# Altium schematic sheet karmanDB_MCU.SchDoc
size A
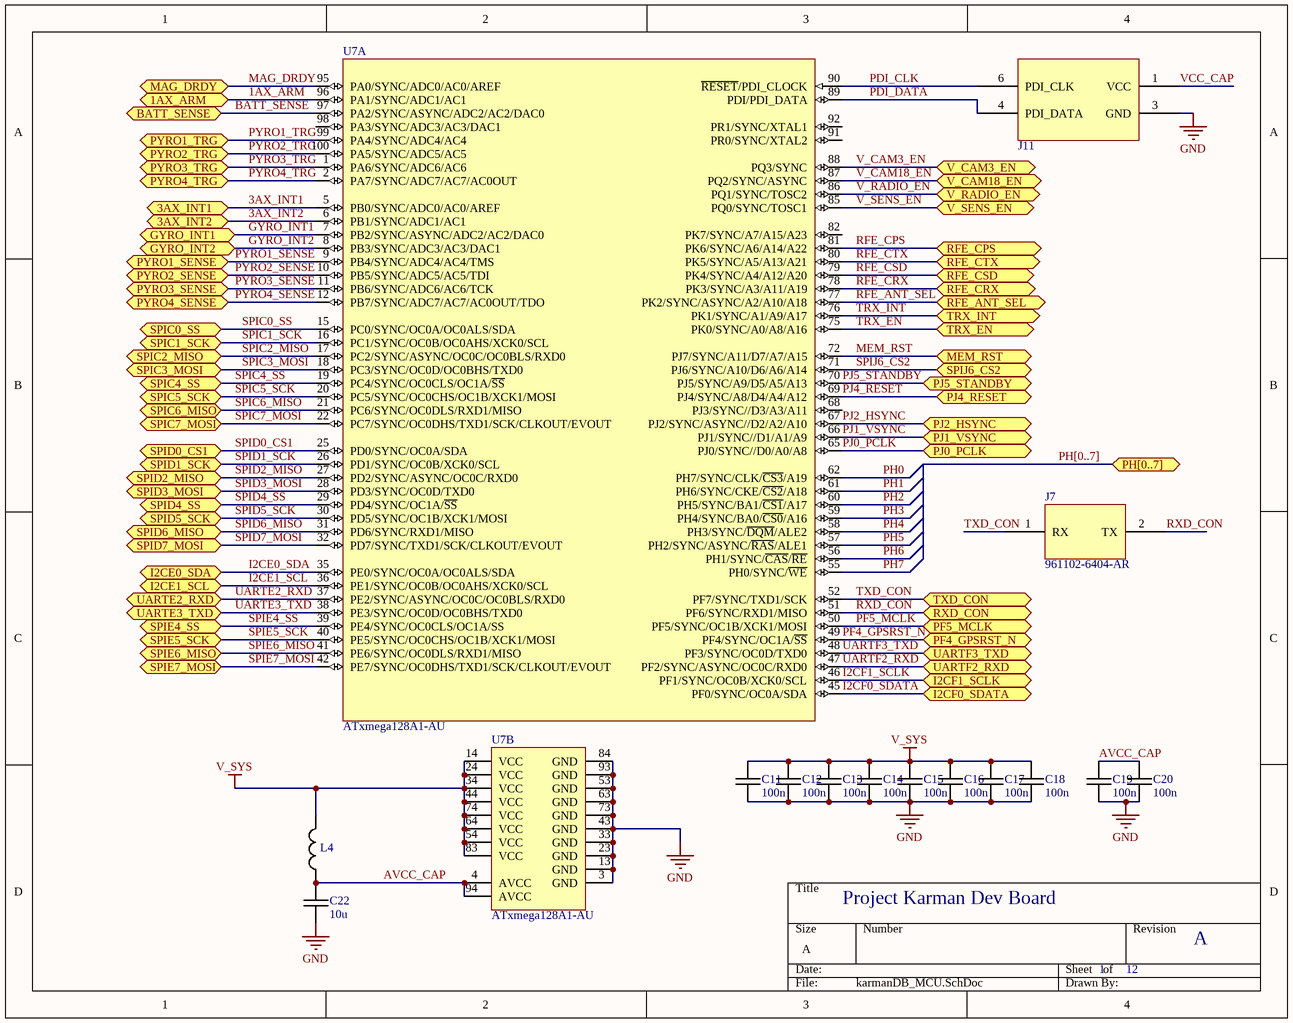
[diagram p0: karmanDB_MCU.SchDoc]

## Parts
C11  100n  [MURATA_GRM_0603]
C12  100n  [MURATA_GRM_0603]
C13  100n  [MURATA_GRM_0603]
C14  100n  [MURATA_GRM_0603]
C15  100n  [MURATA_GRM_0603]
C16  100n  [MURATA_GRM_0603]
C17  100n  [MURATA_GRM_0603]
C18  100n  [MURATA_GRM_0603]
C19  100n  [MURATA_GRM_0603]
C20  100n  [MURATA_GRM_0603]
C22  10u  [MURATA_GRM_0603]
J7  961102-6404-AR  [3M_961102-6X04]
J11  961206-6404-AR  [961206-6404-AR]  (value not drawn)
L4  BLM15BB221SN1D  [BLM15]  (value not drawn)
U7  ATxmega128A1-AU  [100A_N]  (parts A,B of 2)

## Ports
1AX_ARM (bidir), 3AX_INT1 (bidir), 3AX_INT2 (bidir), BATT_SENSE (bidir), GYRO_INT1 (bidir), GYRO_INT2 (bidir), I2CE0_SDA (bidir), I2CE1_SCL (bidir), I2CF0_SDATA (bidir), I2CF1_SCLK (bidir), MAG_DRDY (bidir), MEM_RST (bidir), PF4_GPSRST_N (bidir), PF5_MCLK (bidir), PH[0..7] (bidir), PJ0_PCLK (bidir), PJ1_VSYNC (bidir), PJ2_HSYNC (bidir), PJ4_RESET (bidir), PJ5_STANDBY (bidir), PYRO1_SENSE (bidir), PYRO1_TRG (bidir), PYRO2_SENSE (bidir), PYRO2_TRG (bidir), PYRO3_SENSE (bidir), PYRO3_TRG (bidir), PYRO4_SENSE (bidir), PYRO4_TRG (bidir), RFE_ANT_SEL (bidir), RFE_CPS (bidir), RFE_CRX (bidir), RFE_CSD (bidir), RFE_CTX (bidir), RXD_CON (bidir), SPIC0_SS (bidir), SPIC1_SCK (bidir), SPIC2_MISO (bidir), SPIC3_MOSI (bidir), SPIC4_SS (bidir), SPIC5_SCK (bidir), SPIC6_MISO (bidir), SPIC7_MOSI (bidir), SPID0_CS1 (bidir), SPID1_SCK (bidir), SPID2_MISO (bidir), SPID3_MOSI (bidir), SPID4_SS (bidir), SPID5_SCK (bidir), SPID6_MISO (bidir), SPID7_MOSI (bidir), SPIE4_SS (bidir), SPIE5_SCK (bidir), SPIE6_MISO (bidir), SPIE7_MOSI (bidir), SPIJ6_CS2 (bidir), TRX_EN (bidir), TRX_INT (bidir), TXD_CON (bidir), UARTE2_RXD (bidir), UARTE3_TXD (bidir), UARTF2_RXD (bidir), UARTF3_TXD (bidir), V_CAM3_EN (bidir), V_CAM18_EN (bidir), V_RADIO_EN (bidir), V_SENS_EN (bidir)

## Nets
GND: C11.2 C12.2 C13.2 C14.2 C15.2 C16.2 C17.2 C18.2 C19.2 C20.2 C22.2 J11.3(GND) U7.3(GND) U7.13(GND) U7.23(GND) U7.33(GND) U7.43(GND) U7.53(GND) U7.63(GND) U7.73(GND) U7.84(GND) U7.93(GND)
V_SYS: C11.1 C12.1 C13.1 C14.1 C15.1 C16.1 C17.1 C18.1 L4.2 U7.14(VCC) U7.24(VCC) U7.34(VCC) U7.44(VCC) U7.54(VCC) U7.64(VCC) U7.74(VCC) U7.83(VCC)
1AX_ARM: U7.96(PA1/SYNC/ADC1/AC1) ; port 1AX_ARM
3AX_INT1: U7.5(PB0/SYNC/ADC0/AC0/AREF) ; port 3AX_INT1
3AX_INT2: U7.6(PB1/SYNC/ADC1/AC1) ; port 3AX_INT2
AVCC_CAP: C19.1 C20.1 C22.1 L4.1 U7.4(AVCC) U7.94(AVCC)
BATT_SENSE: U7.97(PA2/SYNC/ASYNC/ADC2/AC2/DAC0) ; port BATT_SENSE
GYRO_INT1: U7.7(PB2/SYNC/ASYNC/ADC2/AC2/DAC0) ; port GYRO_INT1
GYRO_INT2: U7.8(PB3/SYNC/ADC3/AC3/DAC1) ; port GYRO_INT2
I2CE0_SDA: U7.35(PE0/SYNC/OC0A/OC0ALS/SDA) ; port I2CE0_SDA
I2CE1_SCL: U7.36(PE1/SYNC/OC0B/OC0AHS/XCK0/SCL) ; port I2CE1_SCL
I2CF0_SDATA: U7.45(PF0/SYNC/OC0A/SDA) ; port I2CF0_SDATA
I2CF1_SCLK: U7.46(PF1/SYNC/OC0B/XCK0/SCL) ; port I2CF1_SCLK
MAG_DRDY: U7.95(PA0/SYNC/ADC0/AC0/AREF) ; port MAG_DRDY
MEM_RST: U7.72(PJ7/SYNC/A11/D7/A7/A15) ; port MEM_RST
PDI_CLK: J11.6(PDI_CLK) U7.90(~{RESET}/PDI_CLOCK)
PDI_DATA: J11.4(PDI_DATA) U7.89(PDI/PDI_DATA)
PF4_GPSRST_N: U7.49(PF4/SYNC/OC1A/~{SS}) ; port PF4_GPSRST_N
PF5_MCLK: U7.50(PF5/SYNC/OC1B/XCK1/MOSI) ; port PF5_MCLK
PH0: U7.62(PH7/SYNC/CLK/~{CS3}/A19)
PH1: U7.61(PH6/SYNC/CKE/~{CS2}/A18)
PH2: U7.60(PH5/SYNC/BA1/~{CS1}/A17)
PH3: U7.59(PH4/SYNC/BA0/~{CS0}/A16)
PH4: U7.58(PH3/SYNC/~{DQM}/ALE2)
PH5: U7.57(PH2/SYNC/ASYNC/~{RAS}/ALE1)
PH6: U7.56(PH1/SYNC/~{CAS}/~{RE})
PH7: U7.55(PH0/SYNC/~{WE})
PJ0_PCLK: U7.65(PJ0/SYNC//D0/A0/A8) ; port PJ0_PCLK
PJ1_VSYNC: U7.66(PJ1/SYNC//D1/A1/A9) ; port PJ1_VSYNC
PJ2_HSYNC: U7.67(PJ2/SYNC/ASYNC//D2/A2/A10) ; port PJ2_HSYNC
PJ4_RESET: U7.69(PJ4/SYNC/A8/D4/A4/A12) ; port PJ4_RESET
PJ5_STANDBY: U7.70(PJ5/SYNC/A9/D5/A5/A13) ; port PJ5_STANDBY
PYRO1_SENSE: U7.9(PB4/SYNC/ADC4/AC4/TMS) ; port PYRO1_SENSE
PYRO1_TRG: U7.99(PA4/SYNC/ADC4/AC4) ; port PYRO1_TRG
PYRO2_SENSE: U7.10(PB5/SYNC/ADC5/AC5/TDI) ; port PYRO2_SENSE
PYRO2_TRG: U7.100(PA5/SYNC/ADC5/AC5) ; port PYRO2_TRG
PYRO3_SENSE: U7.11(PB6/SYNC/ADC6/AC6/TCK) ; port PYRO3_SENSE
PYRO3_TRG: U7.1(PA6/SYNC/ADC6/AC6) ; port PYRO3_TRG
PYRO4_SENSE: U7.12(PB7/SYNC/ADC7/AC7/AC0OUT/TDO) ; port PYRO4_SENSE
PYRO4_TRG: U7.2(PA7/SYNC/ADC7/AC7/AC0OUT) ; port PYRO4_TRG
RFE_ANT_SEL: U7.77(PK2/SYNC/ASYNC/A2/A10/A18) ; port RFE_ANT_SEL
RFE_CPS: U7.81(PK6/SYNC/A6/A14/A22) ; port RFE_CPS
RFE_CRX: U7.78(PK3/SYNC/A3/A11/A19) ; port RFE_CRX
RFE_CSD: U7.79(PK4/SYNC/A4/A12/A20) ; port RFE_CSD
RFE_CTX: U7.80(PK5/SYNC/A5/A13/A21) ; port RFE_CTX
RXD_CON: J7.2(TX) U7.51(PF6/SYNC/RXD1/MISO) ; port RXD_CON
SPIC0_SS: U7.15(PC0/SYNC/OC0A/OC0ALS/SDA) ; port SPIC0_SS
SPIC1_SCK: U7.16(PC1/SYNC/OC0B/OC0AHS/XCK0/SCL) ; port SPIC1_SCK
SPIC2_MISO: U7.17(PC2/SYNC/ASYNC/OC0C/OC0BLS/RXD0) ; port SPIC2_MISO
SPIC3_MOSI: U7.18(PC3/SYNC/OC0D/OC0BHS/TXD0) ; port SPIC3_MOSI
SPIC4_SS: U7.19(PC4/SYNC/OC0CLS/OC1A/~{SS}) ; port SPIC4_SS
SPIC5_SCK: U7.20(PC5/SYNC/OC0CHS/OC1B/XCK1/MOSI) ; port SPIC5_SCK
SPIC6_MISO: U7.21(PC6/SYNC/OC0DLS/RXD1/MISO) ; port SPIC6_MISO
SPIC7_MOSI: U7.22(PC7/SYNC/OC0DHS/TXD1/SCK/CLKOUT/EVOUT) ; port SPIC7_MOSI
SPID0_CS1: U7.25(PD0/SYNC/OC0A/SDA) ; port SPID0_CS1
SPID1_SCK: U7.26(PD1/SYNC/OC0B/XCK0/SCL) ; port SPID1_SCK
SPID2_MISO: U7.27(PD2/SYNC/ASYNC/OC0C/RXD0) ; port SPID2_MISO
SPID3_MOSI: U7.28(PD3/SYNC/OC0D/TXD0) ; port SPID3_MOSI
SPID4_SS: U7.29(PD4/SYNC/OC1A/~{SS}) ; port SPID4_SS
SPID5_SCK: U7.30(PD5/SYNC/OC1B/XCK1/MOSI) ; port SPID5_SCK
SPID6_MISO: U7.31(PD6/SYNC/RXD1/MISO) ; port SPID6_MISO
SPID7_MOSI: U7.32(PD7/SYNC/TXD1/SCK/CLKOUT/EVOUT) ; port SPID7_MOSI
SPIE4_SS: U7.39(PE4/SYNC/OC0CLS/OC1A/SS) ; port SPIE4_SS
SPIE5_SCK: U7.40(PE5/SYNC/OC0CHS/OC1B/XCK1/MOSI) ; port SPIE5_SCK
SPIE6_MISO: U7.41(PE6/SYNC/OC0DLS/RXD1/MISO) ; port SPIE6_MISO
SPIE7_MOSI: U7.42(PE7/SYNC/OC0DHS/TXD1/SCK/CLKOUT/EVOUT) ; port SPIE7_MOSI
SPIJ6_CS2: U7.71(PJ6/SYNC/A10/D6/A6/A14) ; port SPIJ6_CS2
TRX_EN: U7.75(PK0/SYNC/A0/A8/A16) ; port TRX_EN
TRX_INT: U7.76(PK1/SYNC/A1/A9/A17) ; port TRX_INT
TXD_CON: J7.1(RX) U7.52(PF7/SYNC/TXD1/SCK) ; port TXD_CON
UARTE2_RXD: U7.37(PE2/SYNC/ASYNC/OC0C/OC0BLS/RXD0) ; port UARTE2_RXD
UARTE3_TXD: U7.38(PE3/SYNC/OC0D/OC0BHS/TXD0) ; port UARTE3_TXD
UARTF2_RXD: U7.47(PF2/SYNC/ASYNC/OC0C/RXD0) ; port UARTF2_RXD
UARTF3_TXD: U7.48(PF3/SYNC/OC0D/TXD0) ; port UARTF3_TXD
V_CAM3_EN: U7.88(PQ3/SYNC) ; port V_CAM3_EN
V_CAM18_EN: U7.87(PQ2/SYNC/ASYNC) ; port V_CAM18_EN
V_RADIO_EN: U7.86(PQ1/SYNC/TOSC2) ; port V_RADIO_EN
V_SENS_EN: U7.85(PQ0/SYNC/TOSC1) ; port V_SENS_EN
VCC_CAP: J11.1(VCC)

Not connected (* = marked no-connect by the designer): U7 68(PJ3/SYNC//D3/A3/A11) 82(PK7/SYNC/A7/A15/A23) 91(PR0/SYNC/XTAL2) 92(PR1/SYNC/XTAL1) 98(PA3/SYNC/ADC3/AC3/DAC1)

## Buses and harness runs
bus PH[0..7] = port PH[0..7]

## Notes on the sheet
- Project Karman Dev Board
- 1
- 12
- A

## Library data of the parts
C11-C20 = CAP_MURATA_GRM188R70J104KA01D: CAP CER 0.1UF 6.3V 10% X7R 0603; Manufacturer: Murata Electronics North America; Capacitance: 0.1µF; Supplier 1: Digi-Key; Supplier Part Number 1: 490-9730-1-ND; Manufacturer Part Number: GRM188R70J104KA01D; RoHS: RoHS Compliant; Category: Capacitors; Stock 1: 25826; Pricing: 1=0.1, 10=0.061, 50=0.0332, 100=0.0281, 250=0.02296, 500=0.01964, 1000=0.0153 (USD); Packaging: Cut Tape (CT); Tolerance: ±10%; Voltage - Rated: 6.3V; Temperature Coefficient: X7R; Mounting Type: Surface Mount, MLCC; Operating Temperature: -55°C ~ 125°C; Applications: General Purpose; Ratings: -; Package / Case: 0603 (1608 Metric); Size / Dimension: 0.063" L x 0.031" W (1.60mm x 0.80mm); Height - Seated (Max): -; Thickness (Max): 0.035" (0.90mm); Lead Spacing: -; Features: -; Lead Style: -; ComponentLink1URL: http://www.murata.com/~/media/webrenewal/support/library/catalog/products/capacitor/mlcc/c02e.ashx; ComponentLink1Description: http://www.murata.com/~/media/webrenewal/support/library/catalog/products/capacitor/mlcc/c02e.ashx
C22 = CAP_MURATA_GRM188R60J106: CAP CER 10UF 6.3V 20% X5R 0603; Manufacturer: Murata Electronics North America; Manufacturer Part Number: GRM188R60J106ME47J; Capacitance: 10µF; Supplier 1: Digi-Key; Supplier Part Number 1: 490-6405-1-ND; RoHS: RoHS Compliant; Category: Capacitors; Stock 1: 159118; Pricing: 1=0.19, 10=0.128, 50=0.0776, 100=0.0651, 250=0.05272, 500=0.0465, 1000=0.03953, 5000=0.03333 (USD); Packaging: Cut Tape (CT); Tolerance: ±20%; Voltage - Rated: 6.3V; Temperature Coefficient: X5R; Mounting Type: Surface Mount, MLCC; Operating Temperature: -55°C ~ 85°C; Applications: General Purpose; Ratings: -; Package / Case: 0603 (1608 Metric); Size / Dimension: 0.063" L x 0.031" W (1.60mm x 0.80mm); Height - Seated (Max): -; Thickness (Max): 0.035" (0.90mm); Lead Spacing: -; Features: -; Lead Style: -; ComponentLink1URL: http://www.murata.com/~/media/webrenewal/support/library/catalog/products/capacitor/mlcc/c02e.ashx; ComponentLink1Description: http://www.murata.com/~/media/webrenewal/support/library/catalog/products/capacitor/mlcc/c02e.ashx
J7 = 961102-6404-AR: CONN HEADER VERT SGL 2POS GOLD; Manufacturer: 3M; Connector Type: Header, Unshrouded; Number of Positions: 2; Number of Positions Loaded: All; Pitch: 0.100" (2.54mm); Supplier 1: Digi-Key; Manufacturer Part Number: 961102-6404-AR; RoHS: RoHS Compliant; Category: Connectors, Interconnects; Stock 1: 60000; Pricing 1: 1=0.16, 10=0.15, 25=0.128, 50=0.112, 100=0.104, 250=0.092, 500=0.088, 1000=0.072, 2500=0.066 (USD); Packaging: Bulk; Contact Type: Male Pin; Number of Rows: 1; Row Spacing: -; Contact Mating Length: 0.217" (5.50mm); Mounting Type: Through Hole; Termination: Solder; Fastening Type: -; Features: -; Contact Finish: Gold; Contact Finish Thickness: Flash; Color: Black; ComponentLink1URL: http://multimedia.3m.com/mws/mediawebserver?66666UuZjcFSLXTtNxTElX&VEVuQEcuZgVs6EVs6E666666--; ComponentLink1Description: http://multimedia.3m.com/mws/mediawebserver?66666UuZjcFSLXTtNxTElX&VEVuQEcuZgVs6EVs6E666666--; Supplier Part Number 1: 3M9447-ND
J11 = 961206-6404-AR: CONN HEADER VERT DUAL 6POS GOLD; Manufacturer: 3M; Connector Type: Header, Unshrouded; Number of Positions: 6; Number of Positions Loaded: All; Pitch: 0.100" (2.54mm); Supplier 1: Digi-Key; Manufacturer Part Number: 961206-6404-AR; RoHS: RoHS Compliant; Category: Connectors, Interconnects; Stock 1: 8455; Pricing 1: 1=0.42, 10=0.39, 25=0.3512, 50=0.312, 100=0.299, 250=0.273, 500=0.26, 1000=0.2145, 2500=0.195 (USD); Packaging: Bulk; Contact Type: Male Pin; Number of Rows: 2; Row Spacing: 0.100" (2.54mm); Contact Mating Length: 0.217" (5.50mm); Mounting Type: Through Hole; Termination: Solder; Fastening Type: -; Features: -; Contact Finish: Gold; Contact Finish Thickness: Flash; Color: Black; ComponentLink1URL: http://multimedia.3m.com/mws/mediawebserver?66666UuZjcFSLXTtNxTElX&VEVuQEcuZgVs6EVs6E666666--; ComponentLink1Description: http://multimedia.3m.com/mws/mediawebserver?66666UuZjcFSLXTtNxTElX&VEVuQEcuZgVs6EVs6E666666--; Supplier Part Number 1: 3M9459-ND
L4 = BLM15BB221SN1D: FERRITE CHIP 220 OHM 200MA 0402; Manufacturer: Murata Electronics North America; Impedance @ Frequency: 220 Ohm @ 100MHz; DC Resistance (DCR): 800 mOhm Max; Filter Type: Differential Mode - Single; Supplier 1: Digi-Key; Manufacturer Part Number: BLM15BB221SN1D; RoHS: RoHS Compliant; Category: Filters; Stock 1: 37626; Pricing 1: 1=0.1, 10=0.083, 50=0.0544, 100=0.047, 250=0.03712, 500=0.03136, 1000=0.0264, 5000=0.02351 (USD); Packaging: Cut Tape (CT); Current Rating: 200mA; Package / Case: 0402 (1005 Metric); Mounting Type: Surface Mount; Height (Max): 0.022" (0.55mm); Size / Dimension: 0.039" L x 0.020" W (1.00mm x 0.50mm); ComponentLink1URL: http://search.murata.co.jp/Ceramy/image/img/PDF/ENG/L0110S0100BLM15B.pdf; ComponentLink1Description: http://search.murata.co.jp/Ceramy/image/img/PDF/ENG/L0110S0100BLM15B.pdf; Supplier Part Number 1: 490-5190-1-ND
U7 = ATxmega128A1-AU: 8/16-bit AVR XMEGA A1 Microcontroller, 1.6-3.6V, 128KB + 8KB Flash, 2KB EEPROM, 8KB SRAM, 100-pin TQFP, Industrial Grade (-40°C to 85°C), Pb-Free; Published: 1-Apr-2010; DatasheetVersion: revK, Feb-2010; PackageVersion: revC, Oct-2001; PackageReference: 100A; Publisher: Altium Limited; PackageDescription: 100-Pin Thin Profile Plastic Quad Flat Pack (TQFP), 14 x 14 x 1.0 mm Body, 0.5 mm Pitch; Supplier 1: Digi-Key; Supplier Part Number 1: ATXMEGA128A1-AU-ND; Supplier 2: Farnell; Supplier Part Number 2: 1704571; Supplier 3: Mouser; Supplier Part Number 3: 556-ATXMEGA128A1-AU; Code_JEDEC: MS-026-AED; ComponentLink1Description: Manufacturer Link; ComponentLink1URL: http://www.atmel.com/products/avr/default.asp?; ComponentLink2Description: ATxmega64A1/128A1/192A1/256A1/384A1 Datasheet; ComponentLink2URL: http://www.atmel.com/dyn/resources/prod_documents/doc8067.pdf; ComponentLink3Description: Atmel.com Home; ComponentLink3URL: http://www.atmel.com